# Altium schematic sheet FPGA_Lattice_XP_Standard_Evaluation_Board.SchDoc
size B; DocumentNumber: 1; SheetNumber: 1; SheetTotal: 1
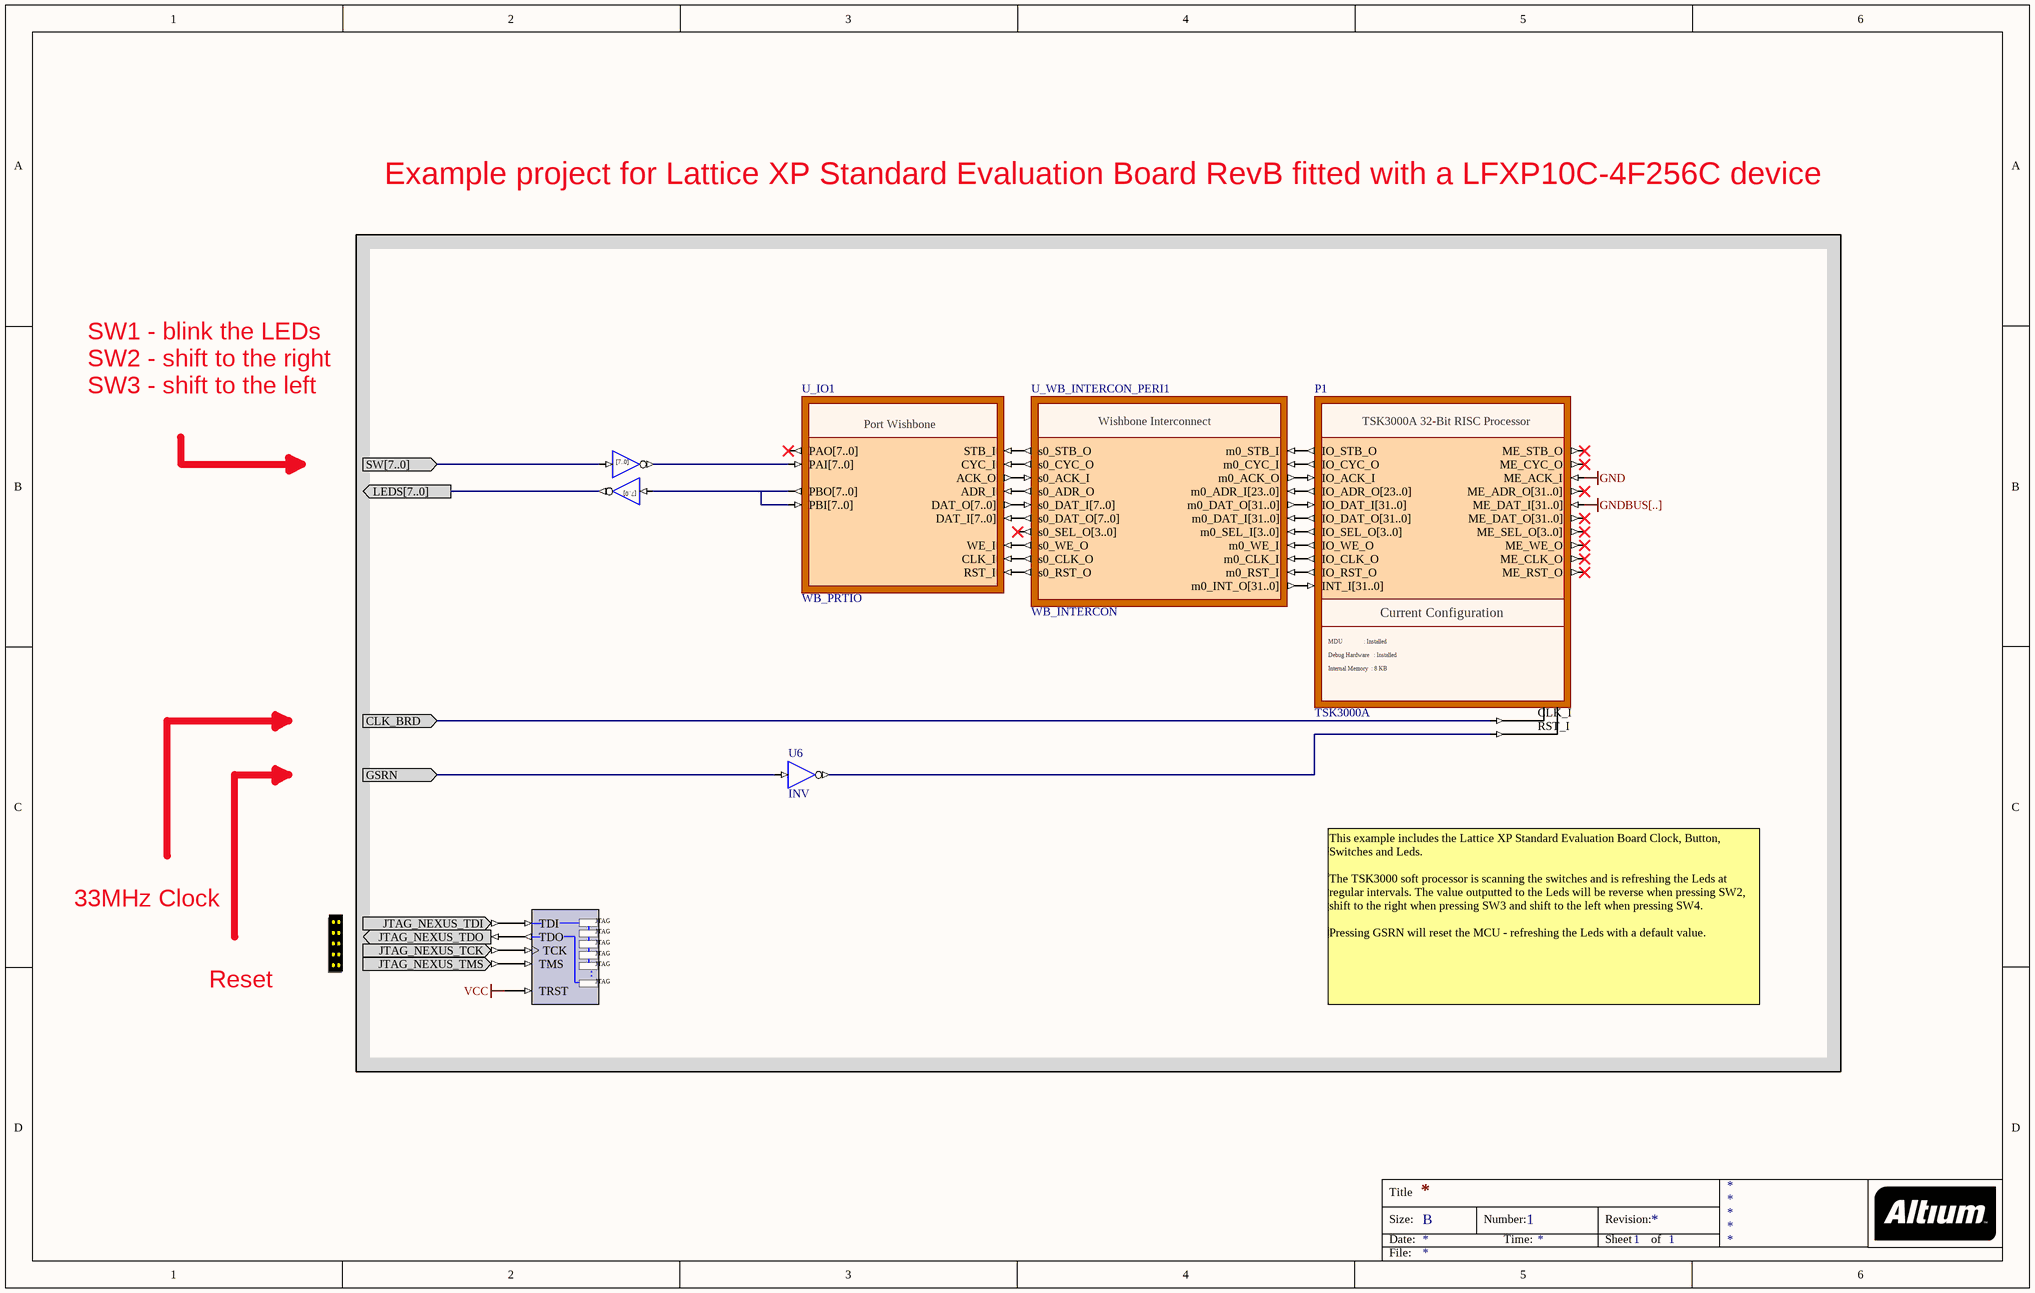
[diagram p0: FPGA_Lattice_XP_Standard_Evaluation_Board.SchDoc]

## Parts
?  NEXUS_JTAG_CONNECTOR  (value not drawn)
NEXUS_JTAG_PORT  NEXUS_JTAG_PORT  (value not drawn)
P1  TSK3000A
U1  INV8B  (value not drawn)
U2  INV8B  (value not drawn)
U6  INV
U_IO1  WB_PRTIO
U_WB_INTERCON_PERI1  WB_INTERCON

## Ports
CLK_BRD (in), GSRN (in), LEDS[7..0] (out), SW[7..0] (in)

## Nets
GND: P1.ME_ACK_I
GNDBUS[..]: P1.ME_DAT_I[31..0]
VCC: NEXUS_JTAG_PORT.TRST
CLK_BRD: P1.CLK_I ; port CLK_BRD
GSRN: U6.I ; port GSRN
LEDS[7..0]: U2.O[7..0] ; port LEDS[7..0]
SW[7..0]: U1.I[7..0] ; port SW[7..0]
Net?_JTAG_NEXUS_TCK: ?.JTAG_NEXUS_TCK NEXUS_JTAG_PORT.TCK
Net?_JTAG_NEXUS_TDI: ?.JTAG_NEXUS_TDI NEXUS_JTAG_PORT.TDI
Net?_JTAG_NEXUS_TDO: ?.JTAG_NEXUS_TDO NEXUS_JTAG_PORT.TDO
Net?_JTAG_NEXUS_TMS: ?.JTAG_NEXUS_TMS NEXUS_JTAG_PORT.TMS
NetP1_INT_I[31..0]: P1.INT_I[31..0] U_WB_INTERCON_PERI1.m0_INT_O[31..0]
NetP1_IO_ACK_I: P1.IO_ACK_I U_WB_INTERCON_PERI1.m0_ACK_O
NetP1_IO_ADR_O[23..0]: P1.IO_ADR_O[23..0] U_WB_INTERCON_PERI1.m0_ADR_I[23..0]
NetP1_IO_CLK_O: P1.IO_CLK_O U_WB_INTERCON_PERI1.m0_CLK_I
NetP1_IO_CYC_O: P1.IO_CYC_O U_WB_INTERCON_PERI1.m0_CYC_I
NetP1_IO_DAT_I[31..0]: P1.IO_DAT_I[31..0] U_WB_INTERCON_PERI1.m0_DAT_O[31..0]
NetP1_IO_DAT_O[31..0]: P1.IO_DAT_O[31..0] U_WB_INTERCON_PERI1.m0_DAT_I[31..0]
NetP1_IO_RST_O: P1.IO_RST_O U_WB_INTERCON_PERI1.m0_RST_I
NetP1_IO_SEL_O[3..0]: P1.IO_SEL_O[3..0] U_WB_INTERCON_PERI1.m0_SEL_I[3..0]
NetP1_IO_STB_O: P1.IO_STB_O U_WB_INTERCON_PERI1.m0_STB_I
NetP1_IO_WE_O: P1.IO_WE_O U_WB_INTERCON_PERI1.m0_WE_I
NetP1_RST_I: P1.RST_I U6.O
NetU1_O[7..0]: U1.O[7..0] U_IO1.PAI[7..0]
NetU2_I[7..0]: U2.I[7..0] U_IO1.PBI[7..0] U_IO1.PBO[7..0]
NetU_IO1_ACK_O: U_IO1.ACK_O U_WB_INTERCON_PERI1.s0_ACK_I
NetU_IO1_ADR_I: U_IO1.ADR_I U_WB_INTERCON_PERI1.s0_ADR_O
NetU_IO1_CLK_I: U_IO1.CLK_I U_WB_INTERCON_PERI1.s0_CLK_O
NetU_IO1_CYC_I: U_IO1.CYC_I U_WB_INTERCON_PERI1.s0_CYC_O
NetU_IO1_DAT_I[7..0]: U_IO1.DAT_I[7..0] U_WB_INTERCON_PERI1.s0_DAT_O[7..0]
NetU_IO1_DAT_O[7..0]: U_IO1.DAT_O[7..0] U_WB_INTERCON_PERI1.s0_DAT_I[7..0]
NetU_IO1_RST_I: U_IO1.RST_I U_WB_INTERCON_PERI1.s0_RST_O
NetU_IO1_STB_I: U_IO1.STB_I U_WB_INTERCON_PERI1.s0_STB_O
NetU_IO1_WE_I: U_IO1.WE_I U_WB_INTERCON_PERI1.s0_WE_O

Not connected (* = marked no-connect by the designer): P1 ME_ADR_O[31..0]* ME_CLK_O* ME_CYC_O* ME_DAT_O[31..0]* ME_RST_O* ME_SEL_O[3..0]* ME_STB_O* ME_WE_O*; U_IO1 PAO[7..0]*; U_WB_INTERCON_PERI1 s0_SEL_O[3..0]*

## Notes on the sheet
- Example project for Lattice XP Standard Evaluation Board RevB fitted with a LFXP10C-4F256C device
- SW1 - blink the LEDs
  SW2 - shift to the right
  SW3 - shift to the left
- 33MHz Clock
- This example includes the Lattice XP Standard Evaluation Board Clock, Button, Switches and Leds.
  The TSK3000 soft processor is scanning the switches and is refreshing the Leds at regular intervals. The value outputted to the Leds will be reverse when pressing SW2, shift to the right when pressing SW3 and shift to the left when pressing SW4.
  Pressing GSRN will reset the MCU - refreshing the Leds with a default value.
- Reset
- Title
- Size:
- Date:
- B
- Number:
- Time:
- Revision:
- Sheet
- of
- File:
- (in symbol INV8B) [7..0]
- (in symbol NEXUS_JTAG_PORT) .
- (in symbol TSK3000A) TSK3000A 32-Bit RISC Processor; Current Configuration; MDU              : Installed; Debug Hardware   : Installed; Internal Memory  : 8 KB
- (in symbol WB_INTERCON) Wishbone Interconnect
- (in symbol WB_PRTIO) Port Wishbone

## Library data of the parts
? = NEXUS_JTAG_CONNECTOR: JTAG Port; PortComponent: True; Published: 19-Nov-2003; Publisher: Altium Limited; HelpURL: TR0102 NanoBoard Technical Reference Manual - NB1.pdf#page=33
NEXUS_JTAG_PORT = NEXUS_JTAG_PORT: Soft Nexus-Chain Connector; NEXUS_JTAG_CONNECTOR: True; FunctionalClass: JTAG; Published: 29-Jan-2004; Publisher: Altium Limited; LastRevisionNo: 1.00.00; HelpURL: CR0118 FPGA Generic Library Guide.pdf#page=405
P1 = TSK3000A: TSK3000A OCD Microprocessor; ChildModel1: TSK3000A_MCU; Nexus_JTAG_Device: True; Nexus_Core: Processor_OCDS; Nexus_JTAG_Order: 10; ProgramLogicalTopAddress: 0; ChildModel2: TSK3000A_MDU; ChildModel3: TSK3000A_OCDS; ChildModel4: TSK3000A_Shift_Barrel; ChildModel5: TSK3000A_Shift_Sequential; ChildModel6: Mult_32x32; ConfigurationParameters: {}Version[1.0]{}Option_Processor[0]{}Option_Memory[3]{}Option_MDU[0]{}Option_OCDS[0]{}Option_Shifter[0]{}Option_InterruptCount[32]{}Option_DebugWhenReset[0]{}; ChildModel7: m33x33; Memory_Configuration: Record[PERIPHERAL]{}ComponentDesignator[IO]{}Memory_Depth[0x0004]{}Memory_UsageType[ram]{}ProgramDownloadAddress[0xFF100000]{}Memory_BusType[TSK3000:addr_bus]{}Memory_Mau[8]{}Memory_MatchedComponent[]{}Memory_Description[U_WB_INTERCON_PERI1]{}Memory_FillBitPattern[]{}Memory_Interrupts[]{n}Record[CODE_EXPORT]{}ExportType[1]{n}Record[NEXUS_CORE]{}ComponentDesignator[P1]{}Memory_Depth[4k]{}Memory_UsageType[rom]{}ProgramDownloadAddress[0]{}Memory_BusType[TSK3000:addr_bus]{}Memory_Mau[8]{}Memory_MatchedComponent[]{}Memory_Description[]{}Memory_FillBitPattern[]{}Memory_Interrupts[]{n}Record[NEXUS_CORE]{}ComponentDesignator[P1_RAM]{}Memory_Depth[4k]{}Memory_UsageType[ram]{}ProgramDownloadAddress[0x01000]{}Memory_BusType[TSK3000:addr_bus]{}Memory_Mau[8]{}Memory_MatchedComponent[]{}Memory_Description[]{}Memory_FillBitPattern[]{}Memory_Interrupts[]{n}; ConfiguratorName: FPGA_MCU32; ComponentLink1Description: Core &Resource Usage; ComponentLink1URL: CR0140 FPGA Processor Resource Usage.pdf#page=16; HelpURL: CR0121 TSK3000A 32 bit RISC Processor.pdf#page=6; LastRevisionNo: 1.00.00; Published: 17-Nov-2004; Publisher: Altium Limited; ComponentLink2Description: Embedded &Tools Guide; ComponentLink2URL: GU0111 Using the TSK3000 Embedded Tools.pdf; ComponentLink3Description: Embedded T&echnical References; ComponentLink3URL: TR0109 TSK3000 Embedded Tools Reference.pdf
U1 U2 = INV8B: 8-Bit Inverter, Bus Version; XilinxEquivalent: INV8; FunctionalClass: Logic Primitive; SubClass: INV; PortSize: 8; ArchiveName: GENERIC; VHDLIB_SIM: GENERIC_LIB; Published: 29-Jan-2004; Publisher: Altium Limited; LastRevisionNo: 1.00.00; HelpURL: CR0118 FPGA Generic Library Guide.pdf#page=291; ComponentLink1URL: CR0136 FPGA Logic Primitive Resource Usage.pdf#page=74; ComponentLink1Description: Core &Resource Usage; PortStyle: Bus Version
U6 = INV: Inverter; ArchiveName: GENERIC; FunctionalClass: Logic Primitive; VHDLIB_SIM: GENERIC_LIB; Published: 18-Dec-2003; Publisher: Altium Limited; ComponentLink1Description: Core &Resource Usage; ComponentLink1URL: CR0136 FPGA Logic Primitive Resource Usage.pdf#page=61; HelpURL: CR0118 FPGA Generic Library Guide.pdf#page=290; LastRevisionNo: 1.00.00; SubClass: INV; XilinxEquivalent: INV
U_IO1 = WB_PRTIO: Configurable Port Wishbone; ChildModel: PRTIO2X8_W; ConfigurationParameters: {}Version[1.0]{}PortCount[2]{}BusWidth[8]{}PortKind[0]{}; ComponentLink1Description: Core &Resource Usage; ComponentLink1URL: CR0139 FPGA Peripheral Resource Usage.pdf#page=63; HelpURL: CR0154 WB_PRTIO Configurable Wishbone Parallel Port Unit.pdf#page=2; LastRevisionNo: 1.00.00; Published: 9-Dec-2004; Publisher: Altium Limited; ConfiguratorName: WB_PRTIO
U_WB_INTERCON_PERI1 = WB_INTERCON: Configurable Wishbone Interconnect; ConfigurationParameters: {}Version[1.0]{}UnusedInterrupts[1]{}MasterAddressBits[1]{}Name0[IO]{}Kind0[0]{}SpaceAfter0[4]{}Address_Base0[1048576]{}Address_UsedRange0[1]{}Address_Bits0[1]{}Address_Mode0[0]{}Address_DecodeWidth0[8]{}DataWidth0[2]{}UsedInterrupts0[ ]; ComponentLink1Description: Core &Resource Usage; ComponentLink1URL: CR0139 FPGA Peripheral Resource Usage.pdf#page=51; HelpURL: CR0150 WB_INTERCON Configurable Wishbone Interconnect.pdf#page=2; LastRevisionNo: 1.00.00; Published: 9-Dec-2004; Publisher: Altium Limited; ConfiguratorName: WB_INTERCON